# EAGLE design Konnektduino.knx.Rev.1.0 (EAGLE 8.6.0)
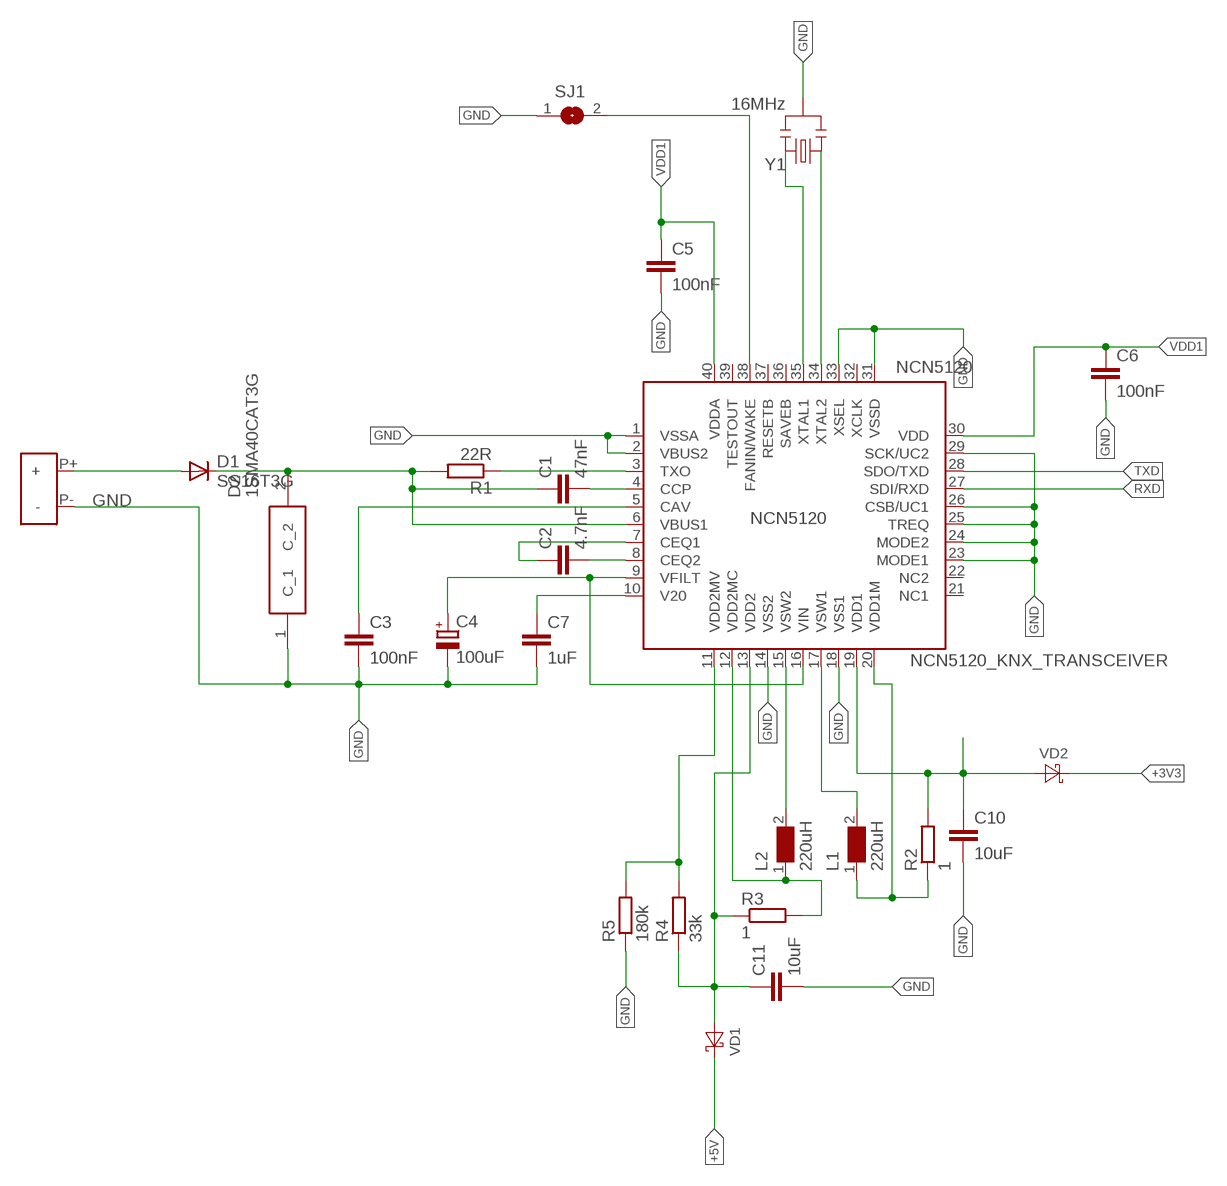
[diagram p0: schematic, sheet 1]

## Parts
C1  47nF  C-EUC0603  [C0603]
C2  4.7nF  C-EUC0603  [C0603]
C3  100nF  C-EUC0603  [C0603]
C4  100uF  CPOL-EUE  [PANASONIC_E]
C5  100nF  C-EUC0603  [C0603]
C6  100nF  C-EUC0603  [C0603]
C7  1uF  C-EUC0603  [C0603]
C10  10uF  C-EUC0603  [C0603]
C11  10uF  C-EUC0603  [C0603]
D1  SS16T3G  DIODESMA-ALT  [SMA-DIODE_ALT]
D2  1SMA40CAT3G  [DIONM5226X220N]
L1  220uH  WE-PD2_7850  [WE-PD2_7850]
L2  220uH  WE-PD2_7850  [WE-PD2_7850]
NCN5120  NCN5120_KNX_TRANSCEIVER  [QFN40]
R1  22R  R-EU_R1218  [R1218]
R2  1  R-EU_R0603  [R0603]
R3  1  R-EU_R0603  [R0603]
R4  33k  R-EU_R0603  [R0603]
R5  180k  R-EU_R0603  [R0603]
SJ1  SJW  [SJW]
U$2  KNX_KLEMME  [KNX_KLEMME]
VD1  DIODE-SCHOTTKY-0603  [D0603]
VD2  DIODE-SCHOTTKY-0603  [D0603]
Y1  16MHz  RESONATORSMD  [RESONATOR-SMD]

## Nets
+3V3: VD2.C
+5V: VD1.C
GND [vcc]: C3.2 C4.- C5.2 C6.2 C7.2 C10.2 C11.2 D2.1(C_1) NCN5120.1(VSSA) NCN5120.2(VBUS2) NCN5120.14(VSS2) NCN5120.18(VSS1) NCN5120.23(MODE1) NCN5120.24(MODE2) NCN5120.25(TREQ) NCN5120.26(CSB/UC1) NCN5120.29(SCK/UC2) NCN5120.31(VSSD) NCN5120.33(XSEL) R5.1 SJ1.1 U$2.P-(-) Y1.2
N$7: C1.1 D1.C D2.2(C_2) NCN5120.6(VBUS1) R1.2
N$8: C2.1 NCN5120.7(CEQ1)
N$9: C4.+ NCN5120.9(VFILT) NCN5120.16(VIN)
N$38: L2.2 NCN5120.15(VSW2)
N$39: C1.2 NCN5120.4(CCP)
N$40: C7.1 NCN5120.10(V20)
N$41: NCN5120.11(VDD2MV) R4.2 R5.2
N$42: L2.1 NCN5120.12(VDD2MC) R3.2
N$140: C3.1 NCN5120.5(CAV)
N$160: C2.2 NCN5120.8(CEQ2)
N$174: NCN5120.38(FANIN/WAKE) SJ1.2
N$203: D1.A U$2.P+(+)
N$222: L1.2 NCN5120.17(VSW1)
N$242: L1.1 NCN5120.20(VDD1M) R2.1
N$999: NCN5120.3(TXO) R1.1
RXD: NCN5120.27(SDI/RXD)
TXAL1: NCN5120.35(XTAL1) Y1.3
TXAL2: NCN5120.34(XTAL2) Y1.1
TXD: NCN5120.28(SDO/TXD)
VDD1: C5.1 C6.1 C10.1 NCN5120.19(VDD1) NCN5120.30(VDD) NCN5120.40(VDDA) R2.2 VD2.A
VDD2: C11.1 NCN5120.13(VDD2) R3.1 R4.1 VD1.A
Unconnected: NCN5120.21(NC1) NCN5120.22(NC2) NCN5120.32(XCLK) NCN5120.36(SAVEB) NCN5120.37(RESETB) NCN5120.39(TESTOUT)

## Library data of the parts
C1-C3 C5-C7 C10 C11 = rcl:C-EU: CAPACITOR, European symbol
C4 = rcl:CPOL-EU: POLARIZED CAPACITOR, European symbol
D1 = SparkFun:DIODE: Diode These are standard reverse protection diodes and small signal diodes. SMA package can handle up to about 1A. SOD-323 can handle about 200mA. What the SOD-323 package when ordering, there are some mfgs out there that are 5-pin packages.
D2 = 1SMA40CAT3G:1SMA40CAT3G: LITTELFUSE - 1SMA40CAT3G - TVS DIODE, 400W, 40V, BIDIR, DO-214AC Source: Datasheet <http://www.littelfuse.com/~/media/electronics/datasheets/tvs_diodes/littelfuse_tvs_diode_1sma10cat3_d_datasheet.pdf.pdf>; ARROW_PART_NUMBER: 1SMA40CAT3G; ARROW_PRICE-STOCK: https://www.arrow.com/en/products/1sma40cat3g/littelfuse; DESCRIPTION: LITTELFUSE - 1SMA40CAT3G - TVS DIODE, 400W, 40V, BIDIR, DO-214AC; HEIGHT: 2.2mm; MANUFACTURER_NAME: LITTELFUSE; MANUFACTURER_PART_NUMBER: 1SMA40CAT3G; RS_PART_NUMBER: 8008942P; RS_PRICE-STOCK: http://uk.rs-online.com/web/p/products/8008942P
L1 L2 = Wuerth_PowerMagnetics:WE-PD2: SMD-Power Inductors WE-PD2 - Industry standard size - Current capability up to 14 A -- Switching regulators with low operating voltages (computer, laptop, mobile phones, pagers) -- Integrated DC/DC-converter -- Is recommended for the application with switching regulators from National Semiconductor, Linear Technology, Texas Instruments and Fairchild Semiconductor -- Perfectly suitable for switching regulators with extremely high efficiency
NCN5120 = Matthias_1:NCN5120_KNX_TRANSCEIVER
R1-R5 = rcl:R-EU_: RESISTOR, European symbol
SJ1 = jumper:SJ: SMD solder JUMPER
U$2 = Matthias_1:KNX_KLEMME
VD1 VD2 = diode:DIODE-SCHOTTKY-: SCHOTTKY DIODE
Y1 = SparkFun:RESONATOR: Resonator Small SMD resonator. This is the itty bitty 10/20MHz resonators with built in caps. CSTCE10M0G55 and CSTCE20M0V53. Footprint has been reviewed closely but hasn't been tested yet.

## Net classes
0 default: width 0.203 mm
1 vcc: width 0.254 mm

## Board
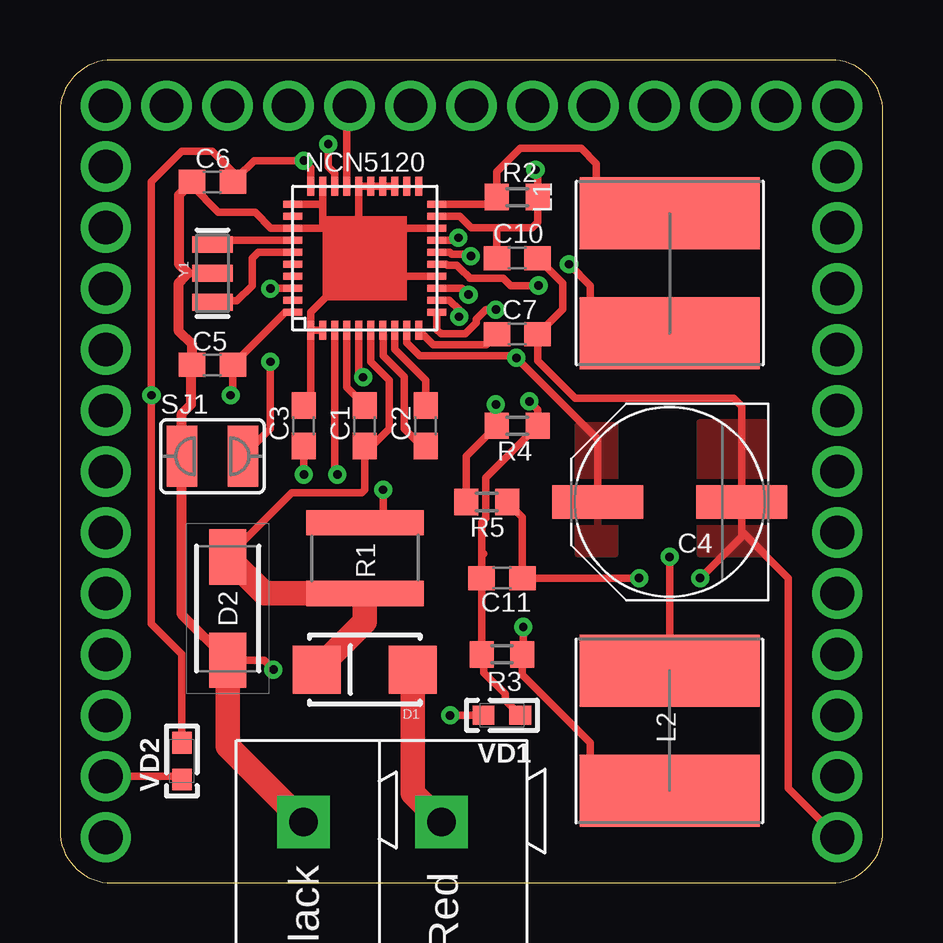
[diagram p1: board, top side]
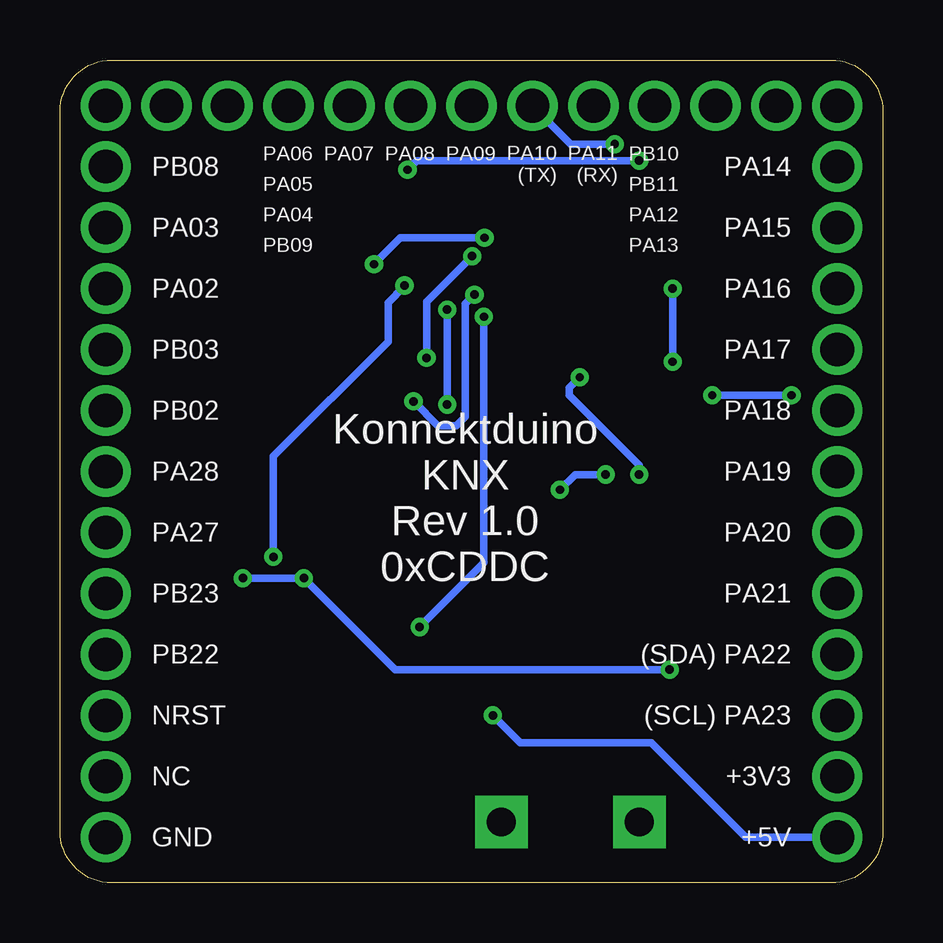
[diagram p2: board, bottom side, seen from below]

Size 34.29 x 34.29 mm. Coordinates in mm from the lower left corner, seen from the top.
Outline: 2.17,0 32.12,0 arc90 34.29,2.17 34.29,32.12 arc90 32.12,34.29 2.17,34.29 arc90 0,32.12 0,2.17 arc90 2.17,0
Copper layers (1*16): Top 0.035mm / dielectric 1.5mm / Bottom 0.035mm
Design rules "default *": minimum track width 6mil, minimum drill 0.35mm, track to track 6mil, track to pad 6mil, pad to pad 6mil, via to via 6mil, smd to smd 6mil, copper to edge 40mil, drill to drill 6mil, minimum pad ring 10mil, minimum via ring 8mil, stop-mask expansion 1mil, vias tented up to drill 25mil, thermal gap 10mil

### Footprints (pad centres in the part's own frame; a part is rotated, then mirrored left to right if it is on the bottom)
C0603 = smd 1.1 x 1: 1 -0.85,0; 2 0.85,0
PANASONIC_E = smd 3.8 x 1.4: + 3,0; - -3,0
SMA-DIODE_ALT = smd 2 x 2: A -2,0; C 2,0
DIONM5226X220N = smd 2.3 x 1.55: 1 -2.15,0; 2 2.15,0
WE-PD2_7850 = smd 3 x 7.5: 1 -2.5,0; 2 2.5,0
QFN40 = smd 0.3 x 0.8: 1 -2.25,-3; 2 -1.75,-3; 3 -1.25,-3; 4 -0.75,-3; 5 -0.25,-3; 6 0.25,-3; 7 0.75,-3; 8 1.25,-3; 9 1.75,-3; 10 2.25,-3; 21 2.25,3; 22 1.75,3; 23 1.25,3; 24 0.75,3; 25 0.25,3; 26 -0.25,3; 27 -0.75,3; 28 -1.25,3; 29 -1.75,3; 30 -2.25,3 | smd 0.8 x 0.3: 11 3,-2.25; 12 3,-1.75; 13 3,-1.25; 14 3,-0.75; 15 3,-0.25; 16 3,0.25; 17 3,0.75; 18 3,1.25; 19 3,1.75; 20 3,2.25; 31 -3,2.25; 32 -3,1.75; 33 -3,1.25; 34 -3,0.75; 35 -3,0.25; 36 -3,-0.25; 37 -3,-0.75; 38 -3,-1.25; 39 -3,-1.75; 40 -3,-2.25
R1218 = smd 1.05 x 4.9: 1 -1.475,0; 2 1.475,0
R0603 = smd 1 x 1.1: 1 -0.85,0; 2 0.85,0
SJW = smd 1.27 x 2.54: 1 -1.27,0; 2 1.27,0
KNX_KLEMME = drill 1.2 pad 2.184 square: P+ 0,-3.2; P- 0,2.55
D0603 = smd 0.9 x 0.8: A 0.762,0; C -0.762,0
RESONATOR-SMD = smd 0.7 x 1.7: 1 -1.2,0; 2 0,0; 3 1.2,0

### Placement (x,y rotation side)
C1  12.7,19.05 90 top
C2  15.24,19.05 90 top
C3  10.16,19.05 90 top
C4  25.4,15.88 180 top
C5  6.35,21.59 180 top
C6  6.35,29.21 180 top
C7  19.05,22.86 0 top
C10  19.05,26.04 0 top
C11  18.41,12.7 0 top
D1  12.7,8.89 180 top
D2  6.99,11.43 90 top
L1  25.4,25.4 270 top
L2  25.4,6.35 90 top
NCN5120  12.7,26.04 0 top
R1  12.7,13.54 270 top
R2  19.05,28.57 0 top
R3  18.41,9.53 0 top
R4  19.05,19.05 180 top
R5  17.78,15.88 180 top
SJ1  6.35,17.78 0 top
U$2  12.7,2.54 90 top
VD1  18.41,6.99 0 top
VD2  5.08,5.08 90 top
Y1  6.35,25.4 270 top

### Tracks (layer width: path | path; a pad name or v marks a point on that pad's centre or on a via)
+3V3  (via drill 1.4)
  Top 0.305: VD2.C 4.95,4.45 v1.91,4.45
+5V  (via drill 0.35, 1.4)
  Top 0.305: VD1.C v16.26,6.99
  Bottom 0.305: v16.26,6.99 15.11,5.84 9.65,5.84 5.71,1.91 v1.91,1.91
GND  (via drill 0.35, 1.4)
  Top 0.305: 5.46,21.55 C5.2 | 5.21,25.27 5.33,25.4 Y1.2 | C6.2 5.5,29.04 6.6,27.94 8.13,27.94 8.78,27.29 NCN5120.33 10.92,27.29 | NCN5120.1 10.45,20.19 C3.2 | 28.4,14.65 C4.- 28.4,19.86 28.07,20.19 21.46,20.19 19.9,21.76 C7.2 20.95,23.91 20.95,24.98 C10.2 | 28.4,14.65 30.35,12.7 30.35,3.94 v32.38,1.91 | R5.1 19.27,15.24 C11.2 v24.13,12.7 | v26.67,12.7 28.4,14.43 28.4,14.65 | NCN5120.18 12.45,27.29 | 12.45,27.29 10.92,27.29 | 12.45,25.29 11.95,25.29 10.45,23.79 NCN5120.1 | 12.45,25.29 NCN5120.14 | NCN5120.1 NCN5120.2 | NCN5120.29 10.95,28.19 | 10.95,28.19 10.95,27.31 10.92,27.29 | NCN5120.31 10.86,28.29 10.95,28.19 | 12.45,27.29 NCN5120.26 NCN5120.25 NCN5120.24 NCN5120.23 | D2.1 8.5,9.28 v8.89,8.89 | 12.45,27.29 12.45,25.29
  Top 0.406: D2.1 5.08,11.19 SJ1.1 5.08,19.56 5.46,19.94 5.46,21.55 | C5.2 5.5,22.44 4.95,22.99 4.95,25.02 5.21,25.27 | C6.2 4.95,28.66 4.95,25.78 5.33,25.4
  Top 1.016: U$2.P- 6.99,5.71 D2.1
  Bottom 0.305: v26.67,12.7 v24.13,12.7 20.32,8.89 v8.89,8.89
  pour Top: 26.67,19.18 26.67,13.72 29.34,13.72 29.34,19.18
N$1  (via drill 1.4)
  other vias: 32.38,6.99
N$2  (via drill 1.4)
  other vias: 32.38,9.53
N$3  (via drill 1.4)
  other vias: 32.38,12.06
N$4  (via drill 1.4)
  other vias: 32.38,14.61
N$5  (via drill 1.4)
  other vias: 32.38,17.14
N$6  (via drill 1.4)
  other vias: 32.38,19.68
N$7
  Top 0.305: NCN5120.6 12.95,21.72 13.72,20.95 13.72,18.92 12.99,18.2 C1.1 | 12.7,18.16 C1.1 | C1.1 12.7,16.38 12.57,16.26 9.65,16.26 D2.2
  Top 1.016: D1.C 12.7,10.89 R1.2 8.5,12.06 D2.2
N$8
  Top 0.305: NCN5120.7 13.46,23.02 13.46,21.97 14.35,21.08 14.35,18.92 15.07,18.2 C2.1
N$9  (via drill 0.35)
  Top 0.305: C4.+ 22.4,18.49 v19.02,21.88 18.92,21.97 14.99,21.97 14.45,22.51 NCN5120.9 | NCN5120.16 16.23,26.29 16.32,26.2 17.04,26.2 v17.12,26.12
  Bottom 0.305: v19.02,21.88 19.02,24.22 v17.12,26.12
  pour Top: 21.59,19.05 21.59,13.72 23.11,13.72 23.11,19.05
N$10  (via drill 1.4)
  other vias: 32.38,22.23
N$11  (via drill 1.4)
  other vias: 32.38,24.77
N$12  (via drill 1.4)
  other vias: 32.38,27.3
N$13  (via drill 1.4)
  other vias: 32.38,29.84
N$14  (via drill 1.4)
  other vias: 32.38,32.38
N$15  (via drill 1.4)
  other vias: 29.84,32.38
N$16  (via drill 1.4)
  other vias: 27.3,32.38
N$17  (via drill 1.4)
  other vias: 24.77,32.38
N$18  (via drill 1.4)
  other vias: 22.23,32.38
N$19  (via drill 1.4)
  other vias: 19.68,32.38
N$20  (via drill 1.4)
  other vias: 17.14,32.38
N$23  (via drill 1.4)
  other vias: 9.53,32.38
N$24  (via drill 1.4)
  other vias: 6.99,32.38
N$25  (via drill 1.4)
  other vias: 4.45,32.38
N$26  (via drill 1.4)
  other vias: 1.91,32.38
N$27  (via drill 1.4)
  other vias: 1.91,29.84
N$28  (via drill 1.4)
  other vias: 1.91,27.3
N$29  (via drill 1.4)
  other vias: 1.91,24.77
N$30  (via drill 1.4)
  other vias: 1.91,22.23
N$31  (via drill 1.4)
  other vias: 1.91,19.68
N$32  (via drill 1.4)
  other vias: 1.91,17.14
N$33  (via drill 1.4)
  other vias: 1.91,14.61
N$34  (via drill 1.4)
  other vias: 1.91,12.06
N$35  (via drill 1.4)
  other vias: 1.91,9.53
N$36  (via drill 1.4)
  other vias: 1.91,6.99
N$37  (via drill 1.4)
  other vias: 32.38,4.45
N$38  (via drill 0.35)
  Top 0.305: NCN5120.15 16.09,25.79 16.13,25.74 16.53,25.74 16.69,25.58 17.04,25.23 17.07,25.2 18.47,25.2 18.77,24.89 v19.94,24.89 | v25.4,13.59 L2.2
  Bottom 0.305: v25.4,13.59 25.4,17.78 20.62,22.56 20.62,24.17 19.94,24.86 v19.94,24.89
N$39
  Top 0.305: NCN5120.4 11.95,20.65 C1.2
N$40
  Top 0.305: 18.02,23.04 C7.1 17.77,22.43 15.56,22.43 NCN5120.10
N$41  (via drill 0.35)
  Top 0.305: R5.2 16.93,17.78 R4.2 18.2,19.9 v18.16,19.94 | 18.05,23.79 v18.16,23.89 | 18.15,23.88 v18.16,23.89 | NCN5120.11 15.7,23.06 15.88,22.89 16.89,22.89 17.34,23.34 17.34,23.49 17.75,23.89 v18.16,23.89
  Bottom 0.305: v18.16,23.89 v18.16,19.94
N$42  (via drill 0.35)
  Top 0.305: L2.1 25.36,3.81 22.1,3.81 22.1,5.84 19.27,8.68 R3.2 19.3,9.56 v19.3,10.67 | NCN5120.12 16.23,24.29 16.63,23.88 v16.63,23.59
  Bottom 0.305: v16.63,23.59 16.63,13.34 v19.3,10.67
N$140  (via drill 0.35)
  Top 0.305: NCN5120.5 12.45,21.25 v12.63,21.07 | v10.16,17.02 C3.1
  Bottom 0.305: v12.63,21.07 13.08,20.62 13.08,20.32 10.16,17.4 v10.16,17.02
N$160
  Top 0.305: C2.2 15.24,20.19 15.24,20.32 15.24,20.95 13.95,22.25 NCN5120.8
N$174  (via drill 0.35)
  Top 0.305: SJ1.2 8.76,18.92 v8.76,21.72 | v8.76,24.77 8.78,24.79 NCN5120.38
  Bottom 0.305: v8.76,21.72 v8.76,24.77
N$203
  Top 1.016: U$2.P+ 14.7,3.74 D1.A
N$222  (via drill 0.35)
  Top 0.305: NCN5120.17 16.5,26.79 v16.6,26.88 | v21.21,25.78 22.1,24.89 22.1,22.99 22.23,22.86 22.27,22.9 L1.2
  Bottom 0.305: v16.6,26.88 20.11,26.88 v21.21,25.78
N$242
  Top 0.305: 18.2,28.87 R2.1 | R2.1 17.91,28.29 NCN5120.20 | R2.1 18.2,29.63 19.18,30.61 21.72,30.61 22.35,29.97 22.35,27.94 25.36,27.94 L1.1
N$999  (via drill 0.35)
  Top 0.305: 11.45,15.13 11.3,14.99 12.67,14.99 | 12.67,14.99 R1.1 | NCN5120.3 11.45,17.12 v11.56,17.02 | v13.46,16.38 13.46,14.99 13.59,14.86 13.72,14.99 | 13.97,15.24 13.72,14.99 | 13.72,14.99 12.67,14.99
  Bottom 0.305: v11.56,17.02 12.83,17.02 v13.46,16.38
RXD  (via drill 1.4)
  Top 0.305: NCN5120.27 11.95,32.27 v12.06,32.38
TXAL1
  Top 0.305: NCN5120.35 8.25,26.29 8,26.04 8,24.89 7.37,24.26 6.41,24.26 Y1.3
TXAL2
  Top 0.305: NCN5120.34 6.54,26.79 Y1.1
TXD  (via drill 0.35, 1.4)
  Top 0.305: NCN5120.28 11.45,29.57 11.18,29.84 11.18,30.48 11.18,30.66 v11.18,30.78
  Bottom 0.305: v11.18,30.78 13,30.78 v14.61,32.38
VDD1  (via drill 0.35)
  Top 0.305: 18.16,27.3 17.14,27.3 16.66,27.79 NCN5120.19 | 18.16,27.3 19.68,27.3 19.9,27.52 R2.2 19.9,29.63 v19.81,29.72 | C10.1 18.2,27.27 18.16,27.3 | NCN5120.40 9.39,23.79 C5.1 7.2,20.41 v7.11,20.32 | NCN5120.30 10.45,29.81 v10.16,30.1 8.09,30.1 7.41,29.42 | 7.41,29.42 C6.1 | VD2.A 5.08,9.53 3.81,10.79 v3.81,20.32 3.81,29.21 5.08,30.48 6.35,30.48 7.41,29.42
  Bottom 0.305: v3.81,20.32 v7.11,20.32 | v19.81,29.72 19.43,30.1 v10.16,30.1
VDD2  (via drill 0.35)
  Top 0.305: VD1.A 18.54,7.62 18.54,7.87 17.65,8.76 17.65,9.44 R3.1 C11.1 | C11.1 17.57,13.63 17.65,13.72 | C11.1 17.57,15.03 17.73,15.2 17.73,16.89 R4.1 19.9,19.72 v19.56,20.07 | NCN5120.13 16.74,24.79 v17.02,24.51
  Bottom 0.305: v17.02,24.51 17.4,24.13 17.4,19.43 17.78,19.05 18.54,19.05 v19.56,20.07

### Text on the board
bNames: PB10 | PA09 | PA08 | PA07 | PA06 | PA14 | PB11 | PA11 / (RX) | PA10 / (TX) | PA05 | PB08 | PA12 | PA04 | PA15 | PA03 | PA13 | PB09 | PA16 | PA02 | PA17 | PB03 | PA18 | PB02 | PA19 | PA28 | Konnektduino / KNX / Rev 1.0 / 0xCDDC | PA20 | PA27 | PA21 | PB23 | (SDA) PA22 | PB22 | (SCL) PA23 | NRST | +3V3 | NC | +5V | GND